# EAGLE design Bio_v4_LCD (EAGLE 7.3.0)
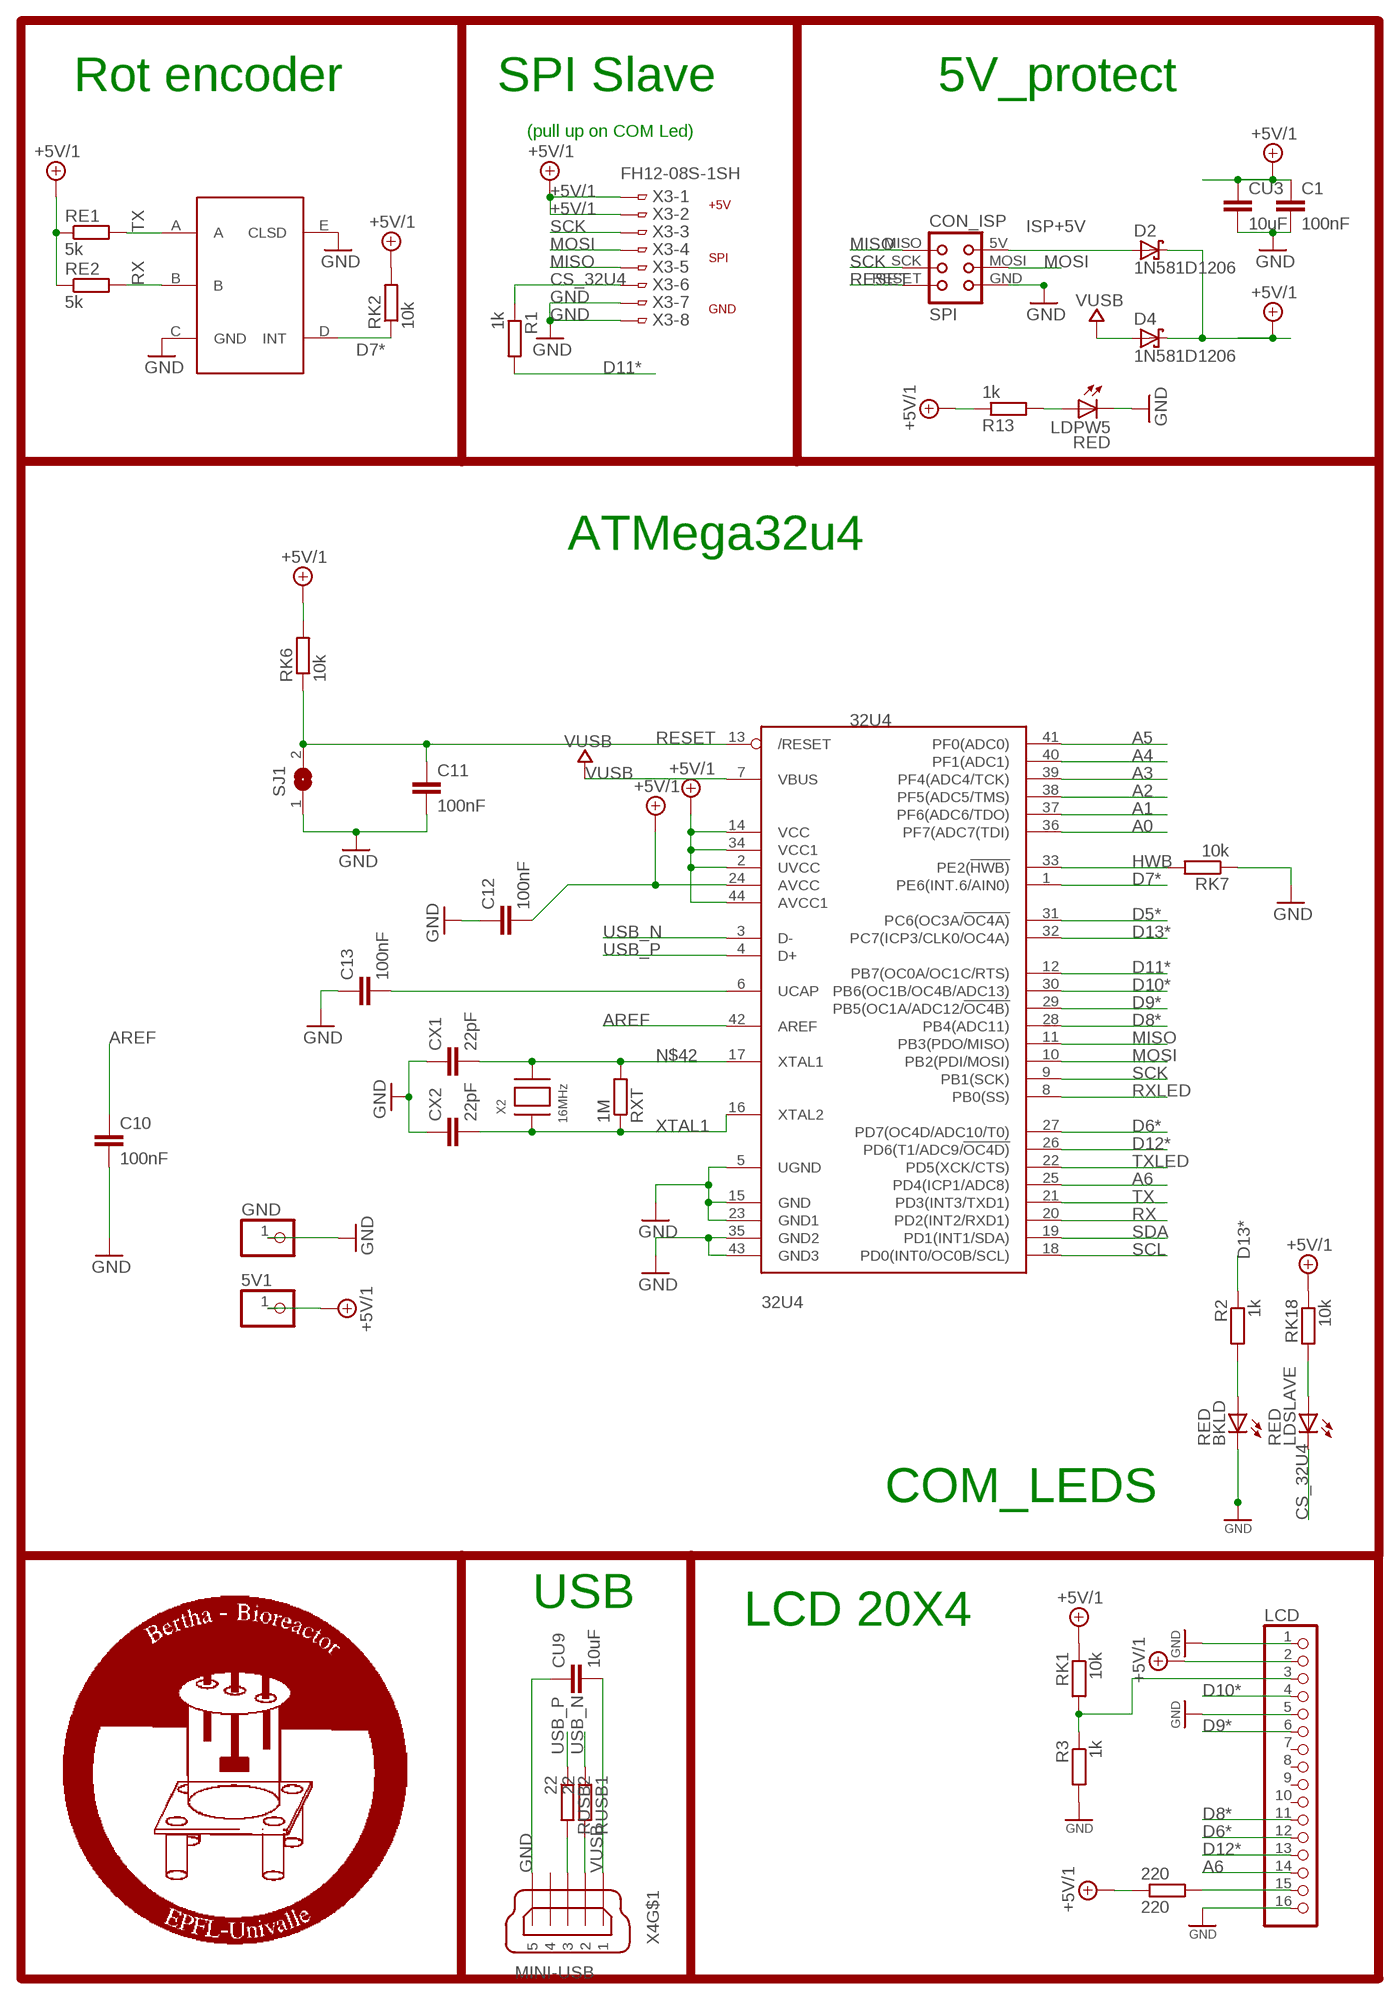
[diagram p0: schematic, sheet 1]

## Parts
5V1  PINHD-1X1  [1X01]
32U4  32U4  ATMEGA32U4-AU  [TQFP44]
220  220  R-EU_R0805  [R0805]
BKLD  RED  LEDCHIP-LED0805  [CHIP-LED0805]
C1  100nF  C-EUC1206  [C1206]
C10  100nF  C-EUC1206  [C1206]
C11  100nF  C-EUC1206  [C1206]
C12  100nF  C-EUC1206  [C1206]
C13  100nF  C-EUC1206  [C1206]
CON_ISP  SPI  TINYISPT  [TC2030-MCP-NL]
CU3  10uF  C-EUC1206  [C1206]
CU9  10uF  C-EUC1206  [C1206]
CX1  22pF  C-EUC1206  [C1206]
CX2  22pF  C-EUC1206  [C1206]
D2  1N581D1206  [LED-1206]
D4  1N581D1206  [LED-1206]
GND  PINHD-1X1  [1X01]
LCD  LCD-HEADER  [1X16]
LDPW5  RED  LEDCHIP-LED0805  [CHIP-LED0805]
LDSLAVE  RED  LEDCHIP-LED0805  [CHIP-LED0805]
R1  1k  R-EU_R0805  [R0805]
R2  1k  R-EU_R0805  [R0805]
R3  1k  R-EU_R0805  [R0805]
R13  1k  R-EU_R0805  [R0805]
RE1  5k  R-EU_R0805  [R0805]
RE2  5k  R-EU_R0805  [R0805]
RK1  10k  R-EU_R0805  [R0805]
RK2  10k  R-EU_M0805  [M0805]
RK6  10k  R-EU_M0805  [M0805]
RK7  10k  R-EU_M0805  [M0805]
RK18  10k  R-EU_R0805  [R0805]
RUSB1  22  R-EU_M1206  [M1206]
RUSB2  22  R-EU_M1206  [M1206]
RXT  1M  R-EU_R0805  [R0805]
SJ1  SJ  [SJ]
U$1  EC11E  [EC11E]
X2  16MHz  XTALNX6035  [NX6035]
X3  FH12-08S-1SH  [FH12-08S-1SH]
X4  MINI-USB  MINI-USB-SCHIELD-32005-201  [32005-201]

## Nets
+5V/1 [fine]: 5V1.1 32U4.2(UVCC) 32U4.14(VCC) 32U4.24(AVCC) 32U4.34(VCC1) 32U4.44(AVCC1) 220.1 C1.1 C12.2 CU3.1 D2.C D4.C LCD.2 R13.1 RE1.1 RE2.1 RK1.1 RK2.2 RK6.2 RK18.1 X3.1 X3.2
A0: 32U4.36(PF7(ADC7(TDI))
A1: 32U4.37(PF6(ADC6/TDO))
A2: 32U4.38(PF5(ADC5/TMS))
A3: 32U4.39(PF4(ADC4/TCK))
A4: 32U4.40(PF1(ADC1))
A5: 32U4.41(PF0(ADC0))
A6: 32U4.25(PD4(ICP1/ADC8)) LCD.14
AREF: 32U4.42(AREF) C10.1
CS_32U4: LDSLAVE.C R1.1 X3.6
D5*: 32U4.31(PC6(OC3A/!OC4A))
D6*: 32U4.27(PD7(OC4D/ADC10/T0)) LCD.12
D7*: 32U4.1(PE6(INT.6/AIN0)) RK2.1 U$1.D(INT)
D8*: 32U4.28(PB4(ADC11)) LCD.11
D9*: 32U4.29(PB5(OC1A/ADC12/!OC4B)) LCD.6
D10*: 32U4.30(PB6(OC1B/OC4B/ADC13)) LCD.4
D11*: 32U4.12(PB7(OC0A/OC1C/RTS)) R1.2
D12*: 32U4.26(PD6(T1/ADC9/!OC4D)) LCD.13
D13*: 32U4.32(PC7(ICP3/CLK0/OC4A)) R2.1
GND [power]: 32U4.5(UGND) 32U4.15(GND) 32U4.23(GND1) 32U4.35(GND2) 32U4.43(GND3) BKLD.C C1.2 C10.2 C11.2 C12.1 C13.1 CON_ISP.GND CU3.2 CU9.1 CX1.1 CX2.1 GND.1 LCD.1 LCD.5 LCD.16 LDPW5.C R3.2 RK7.1 SJ1.1 U$1.C(GND) U$1.E(CLSD) X3.7 X3.8 X4.5
HWB: 32U4.33(PE2(!HWB)) RK7.2
ISP+5V: CON_ISP.5V(VCC) D2.A
MISO: 32U4.11(PB3(PDO/MISO)) CON_ISP.MISO X3.5
MOSI: 32U4.10(PB2(PDI/MOSI)) CON_ISP.MOSI X3.4
N$1: 32U4.6(UCAP) C13.2
N$2: LCD.3 R3.1 RK1.2
N$3: BKLD.A R2.2
N$11: 220.2 LCD.15
N$12: LDPW5.A R13.2
N$22: LDSLAVE.A RK18.2
N$42: 32U4.17(XTAL1) CX1.2 RXT.2 X2.P$2
RESET: 32U4.13(/RESET) C11.1 CON_ISP.RESET RK6.1 SJ1.2
RX: 32U4.20(PD2(INT2/RXD1)) RE2.2 U$1.B
RXLED: 32U4.8(PB0(SS))
SCK: 32U4.9(PB1(SCK)) CON_ISP.SCK X3.3
SCL: 32U4.18(PD0(INT0/OC0B/SCL))
SDA: 32U4.19(PD1(INT1/SDA))
TX: 32U4.21(PD3(INT3/TXD1)) RE1.2 U$1.A
TXLED: 32U4.22(PD5(XCK/CTS))
USB_N: 32U4.3(D-) RUSB1.1
USB_P: 32U4.4(D+) RUSB2.1
USBC_N: RUSB1.2 X4.2
USBC_P: RUSB2.2 X4.3
VUSB: 32U4.7(VBUS) CU9.2 D4.A X4.1
XTAL1: 32U4.16(XTAL2) CX2.2 RXT.1 X2.P$1
Unconnected: LCD.7 LCD.8 LCD.9 LCD.10 X4.4 X4.M1(S:S1) X4.M2(S:S2) X4.M3(S:S3) X4.M4(S:S4)

## Notes on the sheet
- Rot encoder | SPI Slave | 5V_protect
- (pull up on COM Led)
- +5V
- SPI
- GND
- ATMega32u4
- COM_LEDS
- USB
- LCD 20X4

## Library data of the parts
5V1 GND = Headerlibrary:PINHD-1X1: PIN HEADER
32U4 = adafruit:ATMEGA32U4: http://www.ladyada.net/library/eagle
220 R1-R3 RE1 RE2 RK1 RK18 RXT = rcl:R-EU_: RESISTOR, European symbol
BKLD LDPW5 LDSLAVE = adafruit:LED: LED OSRAM: - CHIPLED LG R971, LG N971, LY N971, LG Q971, LY Q971, LO R971, LY R971 LH N974, LH R974 LS Q976, LO Q976, LY Q976 LO Q996 - Hyper CHIPLED LW Q18S LB Q993, LB Q99A, LB R99A - SideLED LS A670, LO A670, LY A670, LG A670, LP A670 LB A673, LV A673, LT A673, LW A673 LH A674 LY A675 LS A676, LA A676, LO A676, LY A676, LW A676 LS A679, LY A679, LG A679 - Hyper Micro SIDELED® LS Y876, LA Y876, LO Y876, LY Y876 LT Y87S - SmartLED LW L88C, LW L88S LB L89C, LB L89S, LG L890 LS L89K, LO L89K, LY L89K LS L896, LA L896, LO L896, LY L896 - TOPLED LS T670, LO T670, LY T670, LG T670, LP T670 LSG T670, LSP T670, LSY T670, LOP T670, LYG T670 LG T671, LOG T671, LSG T671 LB T673, LV T673, LT T673, LW T673 LH T674 LS T676, LA T676, LO T676, LY T676, LB T676, LH T676, LSB T676, LW T676 LB T67C, LV T67C, LT T67C, LS T67K, LO T67K, LY T67K, LW E67C LS E67B, LA E67B, LO E67B, LY E67B, LB E67C, LV E67C, LT E67C LW T67C LS T679, LY T679, LG T679 LS T770, LO T770, LY T770, LG T770, LP T770 LB T773, LV T773, LT T773, LW T773 LH T774 LS E675, LA E675, LY E675, LS T675 LS T776, LA T776, LO T776, LY T776, LB T776 LHGB T686 LT T68C, LB T68C - Hyper Mini TOPLED® LB M676 - Mini TOPLED Santana® LG M470 LS M47K, LO M47K, LY M47K Source: http://www.osram.convergy.de/
C1 C10-C13 CU3 CU9 CX1 CX2 = rcl:C-EU: CAPACITOR, European symbol
CON_ISP = lpatiny:TINYISP: CONNECTOR
D2 D4 = lpatiny:1N581*: 1.0A SCHOTTKY BARRIER RECTIFIER Source: http://www.diodes.com/datasheets/ds23001.pdf
LCD = lpatiny:LCD-HEADER: PIN HEADER
R13 RK2 RK6 RK7 RUSB1 RUSB2 = resistor:R-EU_: RESISTOR, European symbol
SJ1 = jumper:SJ: SMD solder JUMPER
U$1 = lpatiny:EC11E: ALPS Rotary encoder
X2 = lpatiny:XTAL: Low cost SMT crystals, no capacitors included http://www.ladyada.net/library/eagle
X3 = con-hirose:FH12-08S-1S: 1mm Pitch Connectors For FPC/FFC Source: Data sheet <http://www.hirose.co.jp/cataloge_hp/e58605370.pdf>; OC_FARNELL: unknown; OC_NEWARK: unknown
X4 = con-cypressindustries:MINI-USB-SCHIELD-: MINI USB-B Conector Source: www.cypressindustries.com; OC_FARNELL: unknown; OC_NEWARK: unknown

## Net classes
0 default: width 0.203 mm
1 power: width 0.203 mm, drill 0.305 mm, clearance 0.152 mm
2 VIN: width 0.457 mm
3 fine: width 0.254 mm
4 aref: width 0.356 mm

## Board
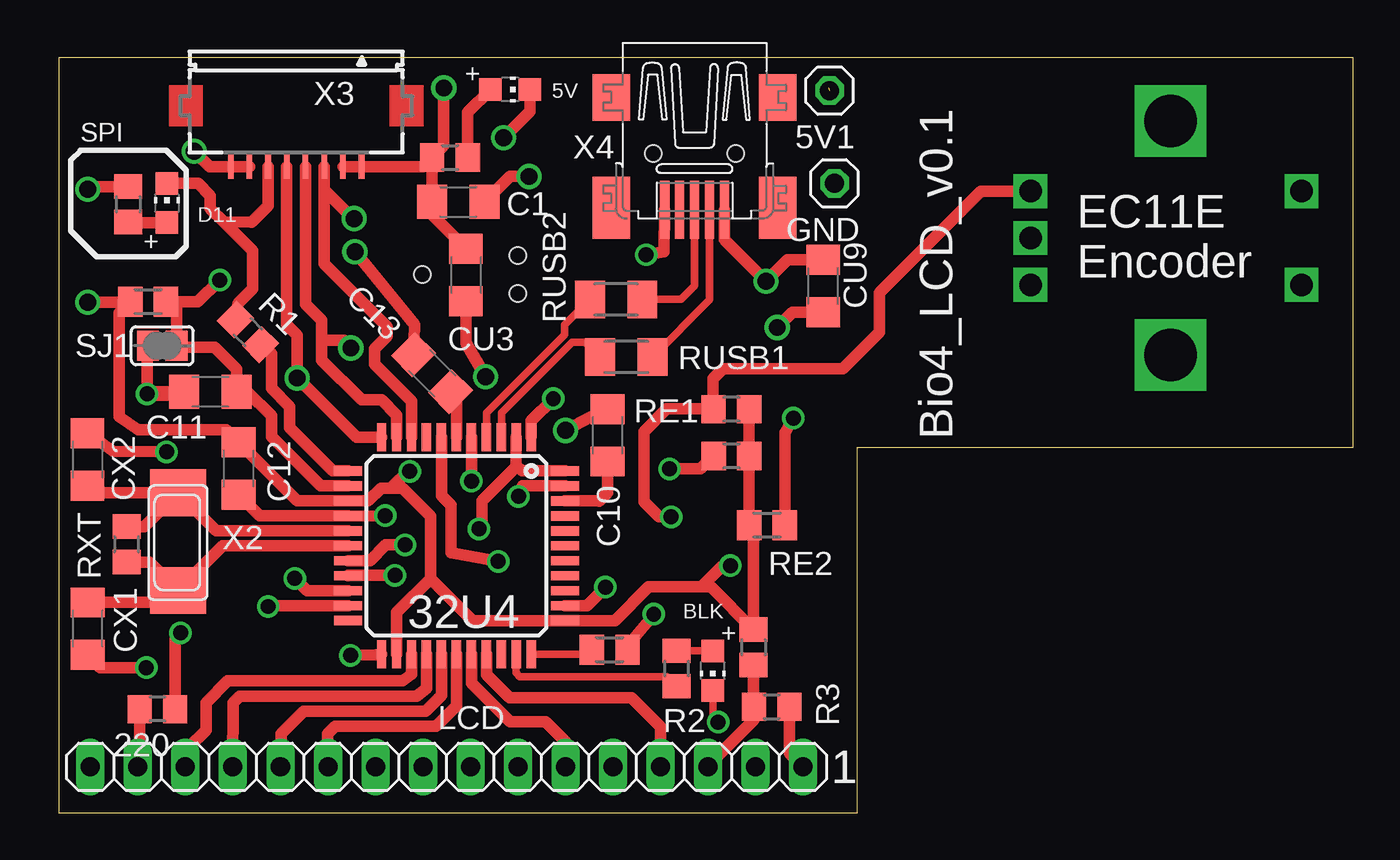
[diagram p1: board, top side]
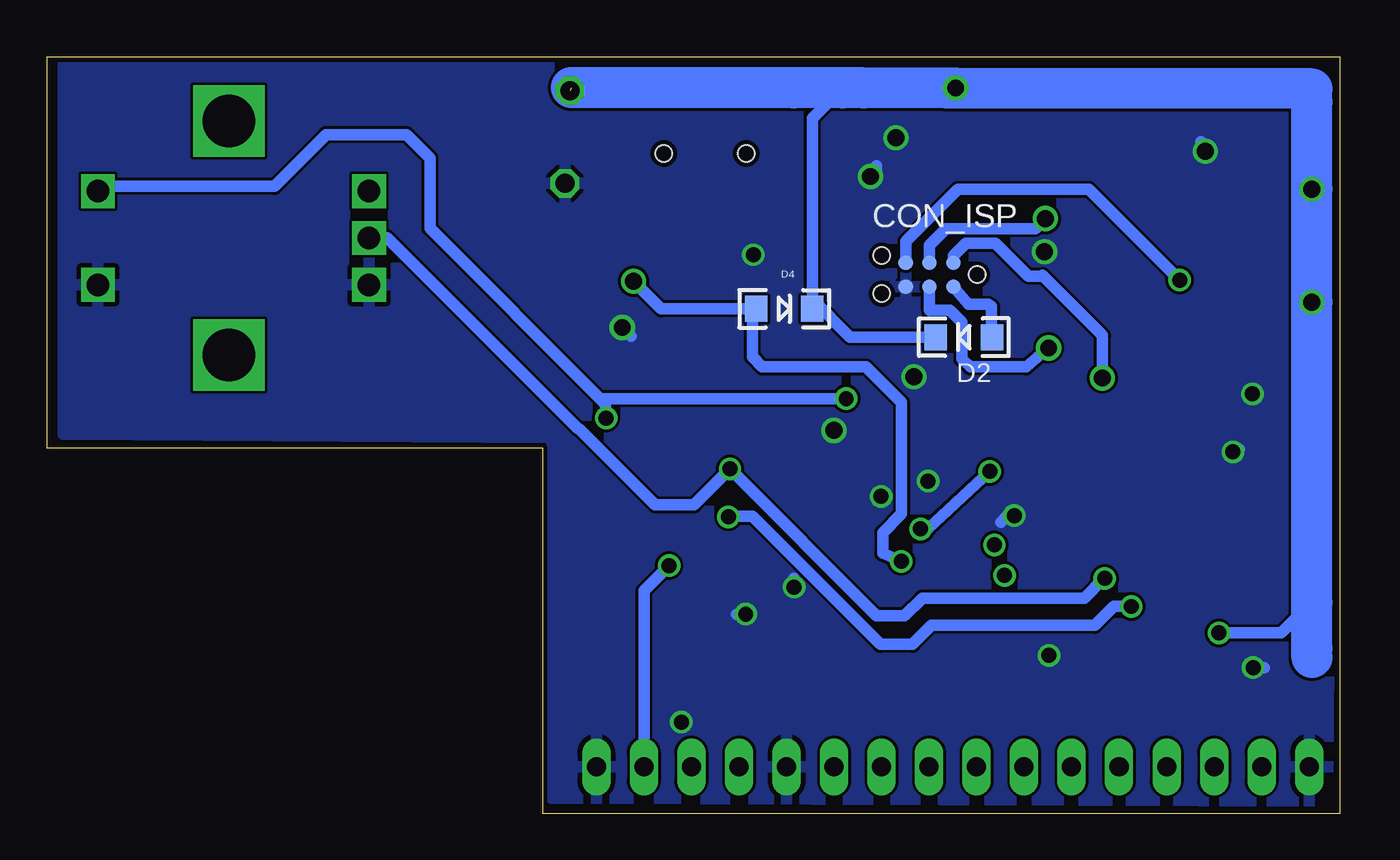
[diagram p2: board, bottom side, seen from below]

Size 69.15 x 40.41 mm. Coordinates in mm from the lower left corner, seen from the top.
Outline: 42.66,0 0,0 0,40.41 69.15,40.41 69.15,19.52 42.66,19.52 42.66,0
Copper layers (1*2*15*16): Top 0.035mm / dielectric 0.2mm / layer 2 0.0175mm / dielectric 1.1mm / layer 15 0.0175mm / dielectric 0.2mm / Bottom 0.035mm
Design rules "SeeedStudio_DRU_no_angle_20130527": minimum track width 6mil, minimum drill 12mil, track to track 6mil, track to pad 6mil, pad to pad 6mil, via to via 6mil, smd to smd 0mil, copper to edge 10mil, drill to drill 10mil, minimum pad ring 6mil, minimum via ring 6mil, stop-mask expansion 2mil, vias tented up to drill 25mil, thermal gap 10mil
vRestrict: area 8.7,33.5 to 16.8,37.3

### Footprints (pad centres in the part's own frame; a part is rotated, then mirrored left to right if it is on the bottom)
1X01 = drill 1.016 octagon: 1 0,0
TQFP44 = smd 1.5 x 0.5: 1 -5.8,4; 2 -5.8,3.2; 3 -5.8,2.4; 4 -5.8,1.6; 5 -5.8,0.8; 6 -5.8,0; 7 -5.8,-0.8; 8 -5.8,-1.6; 9 -5.8,-2.4; 10 -5.8,-3.2; 11 -5.8,-4; 23 5.8,-4; 24 5.8,-3.2; 25 5.8,-2.4; 26 5.8,-1.6; 27 5.8,-0.8; 28 5.8,0; 29 5.8,0.8; 30 5.8,1.6; 31 5.8,2.4; 32 5.8,3.2; 33 5.8,4 | smd 0.5 x 1.5: 12 -4,-5.8; 13 -3.2,-5.8; 14 -2.4,-5.8; 15 -1.6,-5.8; 16 -0.8,-5.8; 17 0,-5.8; 18 0.8,-5.8; 19 1.6,-5.8; 20 2.4,-5.8; 21 3.2,-5.8; 22 4,-5.8; 34 4,5.8; 35 3.2,5.8; 36 2.4,5.8; 37 1.6,5.8; 38 0.8,5.8; 39 0,5.8; 40 -0.8,5.8; 41 -1.6,5.8; 42 -2.4,5.8; 43 -3.2,5.8; 44 -4,5.8
R0805 = smd 1.3 x 1.5: 1 -0.95,0; 2 0.95,0
CHIP-LED0805 = smd 1.2 x 1.2: A 0,-1.05; C 0,1.05
C1206 = smd 1.6 x 1.8: 1 -1.4,0; 2 1.4,0
TC2030-MCP-NL = smd 0.787 x 0.787: 5V 1.27,0.635; GND 3.81,0.635; MISO 1.27,-0.635; MOSI 2.54,0.635; RESET 3.81,-0.635; SCK 2.54,-0.635 | hole 0.889: 0,0; 5.08,-1.016; 5.08,1.016
LED-1206 = smd 1.2 x 1.4: A -1.5,0; C 1.5,0
1X16 = drill 1.016 long: 1 -19.05,0; 2 -16.51,0; 3 -13.97,0; 4 -11.43,0; 5 -8.89,0; 6 -6.35,0; 7 -3.81,0; 8 -1.27,0; 9 1.27,0; 10 3.81,0; 11 6.35,0; 12 8.89,0; 13 11.43,0; 14 13.97,0; 15 16.51,0; 16 19.05,0
M0805 = smd 1.3 x 1.6: 1 -0.95,0; 2 0.95,0
M1206 = smd 1.6 x 2: 1 -1.4,0; 2 1.4,0
SJ = smd 1.168 x 1.6: 1 -0.762,0; 2 0.762,0
EC11E = drill 1.2 square: A -2.5,0; B 0,0; C 2.5,0; D -2.5,14.5; E 2.5,14.5 | drill 2.8 square: P$1 6.25,7.5; P$2 -6.25,7.5
NX6035 = smd 2.5 x 3: P$1 2.665,0; P$2 -2.565,0
FH12-08S-1SH = smd 0.3 x 1.3: 1 -3.5,3.25; 2 -2.5,3.25; 3 -1.5,3.25; 4 -0.5,3.25; 5 0.5,3.25; 6 1.5,3.25; 7 2.5,3.25; 8 3.5,3.25
32005-201 = smd 3.1 x 0.5: 1 3,1.6; 2 3,0.8; 3 3,0; 4 3,-0.8; 5 3,-1.6 | smd 2.5 x 2: M1 -3,-4.45; M2 -3,4.45 | smd 3.3 x 2: M3 2.9,4.45; M4 2.9,-4.45 | hole 0.9: 0,2.2; 0,-2.2

### Placement (x,y rotation side)
5V1  41.19,38.61 180 top
32U4  21.24,14.29 270 top
220  5.25,5.56 180 top
BKLD  34.95,7.61 180 top
C1  21.34,32.67 0 top
C10  29.32,20.19 90 top
C11  8.1,22.52 180 top
C12  9.6,18.41 90 top
C13  19.93,23.52 315 top
CON_ISP  19.43,28.78 180 bottom
CU3  21.75,28.76 270 top
CU9  40.84,28.18 90 top
CX1  1.53,9.86 90 top
CX2  1.52,18.9 270 top
D2  20.12,25.44 180 bottom
D4  29.73,26.95 0 bottom
GND  41.45,33.66 180 top
LCD  20.72,2.47 180 top
LDPW5  24.11,38.67 270 top
LDSLAVE  5.76,32.6 0 top
R1  10.1,25.71 315 top
R2  33.01,7.73 90 top
R3  38.09,5.68 0 top
R13  20.89,35.04 0 top
RE1  35.93,21.59 180 top
RE2  35.94,19.09 180 top
RK1  37.12,8.86 270 top
RK2  37.84,15.39 180 top
RK6  4.76,27.34 180 top
RK7  29.43,8.74 180 top
RK18  3.69,32.54 270 top
RUSB1  30.31,24.38 0 top
RUSB2  29.77,27.45 0 top
RXT  3.6,14.37 270 top
SJ1  5.51,24.98 0 top
U$1  51.92,30.74 270 top
X2  6.36,14.46 90 top
X3  12.67,37.81 180 top
X4  33.97,35.25 270 top

### Tracks (layer width: path | path; a pad name or v marks a point on that pad's centre or on a via)
+5V/1  (via drill 0.8, 0.8 pad 0.81, 0.9, 0.9 pad 0.61)  (1 unrouted)
  Top 0.61: 32U4.24 18.04,10.72 19.85,12.54 | 19.85,12.54 19.85,15.86 18.36,17.35 17.73,17.35 | 17.73,17.35 17.23,17.35 16.51,16.69 15.45,16.69 32U4.14 12.73,16.69 C12.2 8.93,20.48 4.23,20.48 3.21,21.18 3.21,26.74 3.78,27.3 | 19.85,12.54 22.11,10.29 32U4.34 29.71,10.29 31.51,12.09 34.33,12.09 | 32U4.44 24.76,18.29 24.44,18.6 | 32U4.2 24.44,18.6 | 24.44,18.6 24.44,18.5 22.62,16.68 22.62,15.37 v22.44,15.18 | v18.74,18.26 18.74,18.36 17.73,17.35 | RK6.2 3.78,27.3 | 3.78,27.3 v1.52,27.3 | X3.2 X3.1 19.46,34.55 R13.1 | RK18.1 1.66,33.49 v1.52,33.35 | R13.1 20.56,35.66 v20.56,38.75 | R13.1 C1.1 19.94,31.97 CU3.1 | 34.33,12.09 34.84,12.09 RK1.1 | 220.1 6.2,9.34 v6.49,9.63 | RE1.1 RE2.1 RK2.2 37.12,15.16 RK1.1 | 36.89,10.03 RK1.1 | v35.88,13.23 35.47,13.23 34.33,12.09
  Bottom 0.61: v22.44,15.18 22.04,15.18 v18.74,18.26 | 1.52,38 1.52,38.35 1.88,38.71 | v20.56,38.75 v20.57,38.75 21.06,38.75 | v6.49,9.63 3.15,9.63 1.52,11.26 | LCD.2 37.23,11.88 v35.88,13.23 | D4.C 28.23,27.46 | 28.23,27.46 28.23,37.14 26.61,38.76 | D2.C 26.21,25.44 28.23,27.46
  Bottom 2.184: 1.52,8.31 1.52,8.8 1.52,11.26 v1.52,27.3 v1.52,33.35 1.52,38 1.52,38.71 1.88,38.71 v20.56,38.75 21.06,38.75 25.49,38.76 26.61,38.76 29.21,38.76 34.88,38.77 41.13,38.77
A6
  Top 0.61: 32U4.25 18.84,7.42 18.37,7.07 9.02,7.07 7.85,5.91 7.85,4.44 6.93,3.52 6.93,2.32 LCD.14
AREF
  Top 0.61: 32U4.42 28.86,16.69 28.87,16.67 29.32,17.13 C10.1
CS_32U4
  Top 0.61: 8.8,31.59 10.29,31.57 11.17,32.45 X3.6 | LDSLAVE.C 7.43,33.65 8.09,32.99 8.09,32.3 8.8,31.59 | R1.1 9.56,27.24 10.34,28.01 10.34,30.05 8.8,31.59
D6*
  Top 0.61: 32U4.27 20.44,6.29 19.6,5.45 13.07,5.45 11.86,4.24 11.86,2.18 LCD.12
D7*  (via drill 0.8)
  Top 0.61: 32U4.1 25.24,20.98 v26.42,22.16 | RK2.1 38.79,20.34 v39.25,21.11
  Bottom 0.61: v26.42,22.16 39.58,22.16 | 39.58,22.16 48.66,31.24 48.66,35 49.92,36.26 54.22,36.26 56.98,33.5 66.16,33.5 U$1.D | v39.25,21.11 39.27,21.85 39.58,22.16
D8*
  Top 0.61: 32U4.28 21.24,5.73 20.16,4.65 14.75,4.65 14.35,4.25 14.35,2.49 LCD.11
D9*
  Top 0.61: 32U4.29 22.04,6.94 24.1,4.88 26,4.88 27.09,3.79 27.09,2.49 LCD.6
D10*
  Top 0.61: 32U4.30 22.84,7.4 24.08,6.16 30.59,6.16 32.14,4.61 LCD.4
D11*
  Top 0.61: 32U4.12 14.63,18.29 12.32,20.6 12.32,21.73 11.36,22.7 11.36,24.54 R1.2
D12*
  Top 0.61: 32U4.26 19.64,6.68 19.12,6.25 11.68,6.26 9.66,6.26 9.31,5.91 LCD.13
D13*
  Top 0.406: 32U4.32 24.44,7.49 24.62,7.28 32.48,7.28 R2.1
GND  (via drill 0.8, 0.8 pad 0.81, 0.9, 0.9 pad 0.61, 0.9 pad 0.81)
  Top 0.406: BKLD.C 34.95,5.14 v35.22,4.87
  Top 0.61: v17.43,15.89 17.35,15.87 32U4.15 10.73,15.89 C12.1 | 32U4.5 22.04,18.36 v22.05,17.74 | CX2.1 2.89,19.34 v5.75,19.31 | 32U4.23 16.97,8.48 v15.58,8.43 | v4.66,7.78 2.21,7.78 CX1.1 | 32U4.43 24.78,17.49 v24.55,16.93 | C10.2 29.33,21.65 v27.07,20.45 | X3.7 X3.8 8.04,34.55 v7.22,35.37 | SJ1.1 4.7,24.93 v4.7,22.41 | LDPW5.C 25.16,37.5 v23.75,36.09 | C13.1 18.99,26.09 v15.82,30 | C1.2 24.09,34.02 v25.12,34.02 | CU3.2 21.75,25.11 v22.8,23.32 | X4.5 32.35,30 v31.38,29.84 | CU9.1 39.21,26.78 v38.39,25.96 | 32U4.35 28.22,11.09 v29.21,12.08 | RK7.1 30.56,9.13 v31.79,10.64 | LCD.1 39.04,3.2 R3.2
  Top 0.813: C11.2 6.54,22.42 v4.7,22.41
  Bottom 0.406: v35.22,4.87 35.22,4.95 35.34,5.07
  Bottom 0.61: v17.43,15.89 17.82,15.88 18.16,15.55 | v4.66,7.78 4.07,7.78 | v5.75,19.31 5.54,19.32 5.41,19.46 | v7.22,35.37 7.22,35.64 7.47,35.88 | v23.75,36.09 23.89,36.09 23.91,36.11 | v25.12,34.02 24.81,34.34 24.81,34.59 | v22.8,23.32 23.07,23.53 22.97,23.29 | v38.39,25.96 | v38.39,25.96 37.92,25.48 | v29.21,12.08 29.21,12.54 | v31.79,10.64 32.27,10.64
  pour Bottom: 0.44,39.86 0.4,39.89 0.67,0.63 42.17,0.79 42.17,20.07 68.28,20.25 68.28,40.15 1.7,40.25 0.68,40.13
HWB
  Top 0.406: 32U4.33 28.23,8.49 RK7.2
ISP+5V
  Bottom 0.61: CON_ISP.5V 19.87,27.19 18.83,27.19 18.64,27.08 18.64,25.46 D2.A
MISO  (via drill 0.9 pad 0.61)
  Top 0.61: 32U4.11 15.89,20.09 v12.72,23.25 12.72,25.54 12.17,26.09 X3.5
  Bottom 0.61: v12.72,23.25 12.72,25.54 15.92,28.74 15.96,28.7 16.67,28.7 18.44,30.46 20.03,30.46 20.7,29.79 CON_ISP.MISO
MOSI  (via drill 0.9 pad 0.61)
  Top 0.61: 32U4.10 18.04,21.27 17.23,22.08 16.17,22.08 14.04,24.21 14.04,25.26 | 14.04,25.26 14.04,26.34 13.17,27.21 X3.4 | v15.6,24.86 15.24,25.26 14.04,25.26
  Bottom 0.61: v15.6,24.86 16.79,23.85 19.78,23.85 20.16,24.19 20.25,24.28 20.25,26.24 20.87,26.86 21.97,26.86 CON_ISP.MOSI
N$1
  Top 0.61: 32U4.6 21.24,22.14 C13.2
N$2
  Top 0.61: LCD.3 34.69,2.53 37.14,4.98 R3.1 37.12,5.71 RK1.2
N$3
  Top 0.406: R2.2 34.93,8.68 BKLD.A
N$11
  Top 0.61: 220.2 4.3,2.23 LCD.15
N$12
  Top 0.61: R13.2 21.84,37.45 LDPW5.A
N$22
  Top 0.61: LDSLAVE.A 3.72,31.55 RK18.2
N$42
  Top 0.61: 32U4.17 8.75,14.29 X2.P$2 | CX1.2 6.37,11.26 6.96,11.85 6.41,11.85 X2.P$2 | RXT.2 4.84,13.42 X2.P$2
RESET  (via drill 0.8 pad 0.81)
  Top 0.61: 32U4.13 13.98,17.49 11.35,20.11 11.35,21.23 10.05,22.53 9.51,22.53 C11.1 | 9.62,22.39 C11.1 | C11.1 9.49,23.72 8.31,24.9 6.35,24.9 SJ1.2 6.27,27.34 RK6.1 7.42,27.34 v8.59,28.49
  Bottom 0.61: CON_ISP.RESET 23.24,30.55 20.45,33.34 13.44,33.34 v8.59,28.49
RX  (via drill 0.8)
  Top 0.61: 32U4.20 13.26,11.89 v12.6,12.54 | v32.63,18.39 34.3,18.39 RE2.2
  Bottom 0.61: v12.6,12.54 12.64,12.54 13.68,11.5 22.35,11.5 23.29,10.56 24.79,10.56 v32.63,18.39 34.55,16.47 36.63,16.47 40.71,20.55 40.76,20.55 50.95,30.74 U$1.B
SCK  (via drill 0.9 pad 0.61)
  Top 0.61: 32U4.9 18.84,22.02 16.87,23.99 16.87,24.81 17.54,25.49 17.54,25.98 14.17,29.35 14.17,33.31 | X3.3 14.17,33.31 | v15.77,31.77 15.72,31.77 14.17,33.31
  Bottom 0.61: v15.77,31.77 16.31,31.23 21.09,31.23 21.96,30.36 CON_ISP.SCK
SCL  (via drill 0.8 pad 0.81)
  Top 0.61: v18.5,14.33 17.44,14.33 16.61,13.49 15.45,13.49 32U4.18
  Bottom 0.61: v18.5,14.33 18.5,14.16
SDA  (via drill 0.8 pad 0.81)
  Top 0.61: v17.95,12.7 15.46,12.7 32U4.19
  Bottom 0.61: v17.95,12.7 17.99,12.7
TX  (via drill 0.8)
  Top 0.61: 32U4.21 11.22,11.09 v11.17,11.04 | v32.71,15.83 32.08,15.83 31.26,16.64 31.26,20.39 32.48,21.61 34.97,21.61 RE1.2 34.94,21.63 34.94,23.21 35.49,23.75 41.9,23.75 43.85,25.7 43.85,27.8 49.28,33.24 U$1.A
  Bottom 0.61: v11.17,11.04 12.11,11.04 13.12,10.03 21.87,10.03 22.88,9.02 24.6,9.02 31.44,15.86 32.69,15.86 v32.71,15.83
USB_N
  Top 0.406: 32U4.3 23.64,21.39 27.41,25.16 28.12,25.16 RUSB1.1
USB_P
  Top 0.406: 32U4.4 22.84,21.38 27.01,25.56 27.01,26.09 RUSB2.1
USBC_N
  Top 0.406: X4.2 34.77,27.43 RUSB1.2
USBC_P
  Top 0.406: X4.3 33.97,28.19 33.25,27.47 31.19,27.47 RUSB2.2
VUSB  (via drill 0.8 pad 0.81, 0.9)
  Top 0.61: 32U4.7 20.44,16.97 20.94,16.46 20.94,13.91 v23.48,13.46 | X4.1 35.57,30.64 v37.78,28.42 38.94,29.58 CU9.2
  Bottom 0.61: 23.47,13.38 v23.48,13.46 24.46,13.88 24.46,14.99 23.46,15.99 23.46,21.95 25.36,23.85 30.92,23.85 31.44,24.38 31.44,26.74 D4.A | D4.A 36.31,26.95 v37.78,28.42 | D4.A 31.23,26.88
XTAL1
  Top 0.61: 32U4.16 8.4,15.09 X2.P$1 | X2.P$1 1.9,17.13 CX2.2 | RXT.1 4.55,15.32 X2.P$1

### Text on the board
tNames: 5V | SPI | D11 | EC11E / Encoder | Bio4_LCD_v0.1 | BLK | 1
tValues: Screen / v0.1
203bmp: C:/Users/G/Pictures/logo_epfl.bmp